# Altium schematic sheet CR99400.SchDoc: CR99400
size A4; Organization: MicroFPGA UG(h); DocumentNumber: CR99400; Revision: 01; SheetNumber: 2; SheetTotal: 5; Date: 2022-05-16; CheckedBy: AL; Author: AL; CompanyName: MicroFPGA UG(h); DrawnBy: AL
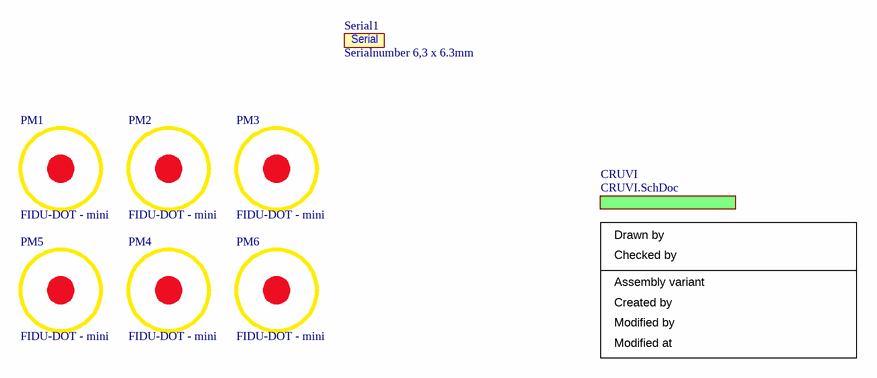
[diagram p0: CR99400.SchDoc]

## Parts
PM1  FIDU-DOT - mini  [FIDU-DOT - mini]
PM2  FIDU-DOT - mini  [FIDU-DOT - mini]
PM3  FIDU-DOT - mini  [FIDU-DOT - mini]
PM4  FIDU-DOT - mini  [FIDU-DOT - mini]
PM5  FIDU-DOT - mini  [FIDU-DOT - mini]
PM6  FIDU-DOT - mini  [FIDU-DOT - mini]
Serial1  Serialnumber 6,3 x 6.3mm  [Serial_6.3x6.3mm]  (no BOM)

## Sub-sheets
CRUVI = CRUVI.SchDoc: no entries

## Notes on the sheet
- Checked by
- Drawn by
- Assembly variant
- Created by
- Modified by
- Modified at
- Title:
- Number:
- Rev.
- Date:
- A4
- Copyright:
- Page
- of
- Filename:

## Library data of the parts
PM1-PM6 = 27037: FIDU-DOT - MINI 0.5mm; AN: 27037; Mixed: FIDU; Preferred: Yes
Serial1 = 26753: AN: 26753; Mixed: MECH; H-ART: 39068; Extra: THT-70-718-20